# EAGLE design XBEE3_Thing_Plus (EAGLE 9.5.2)
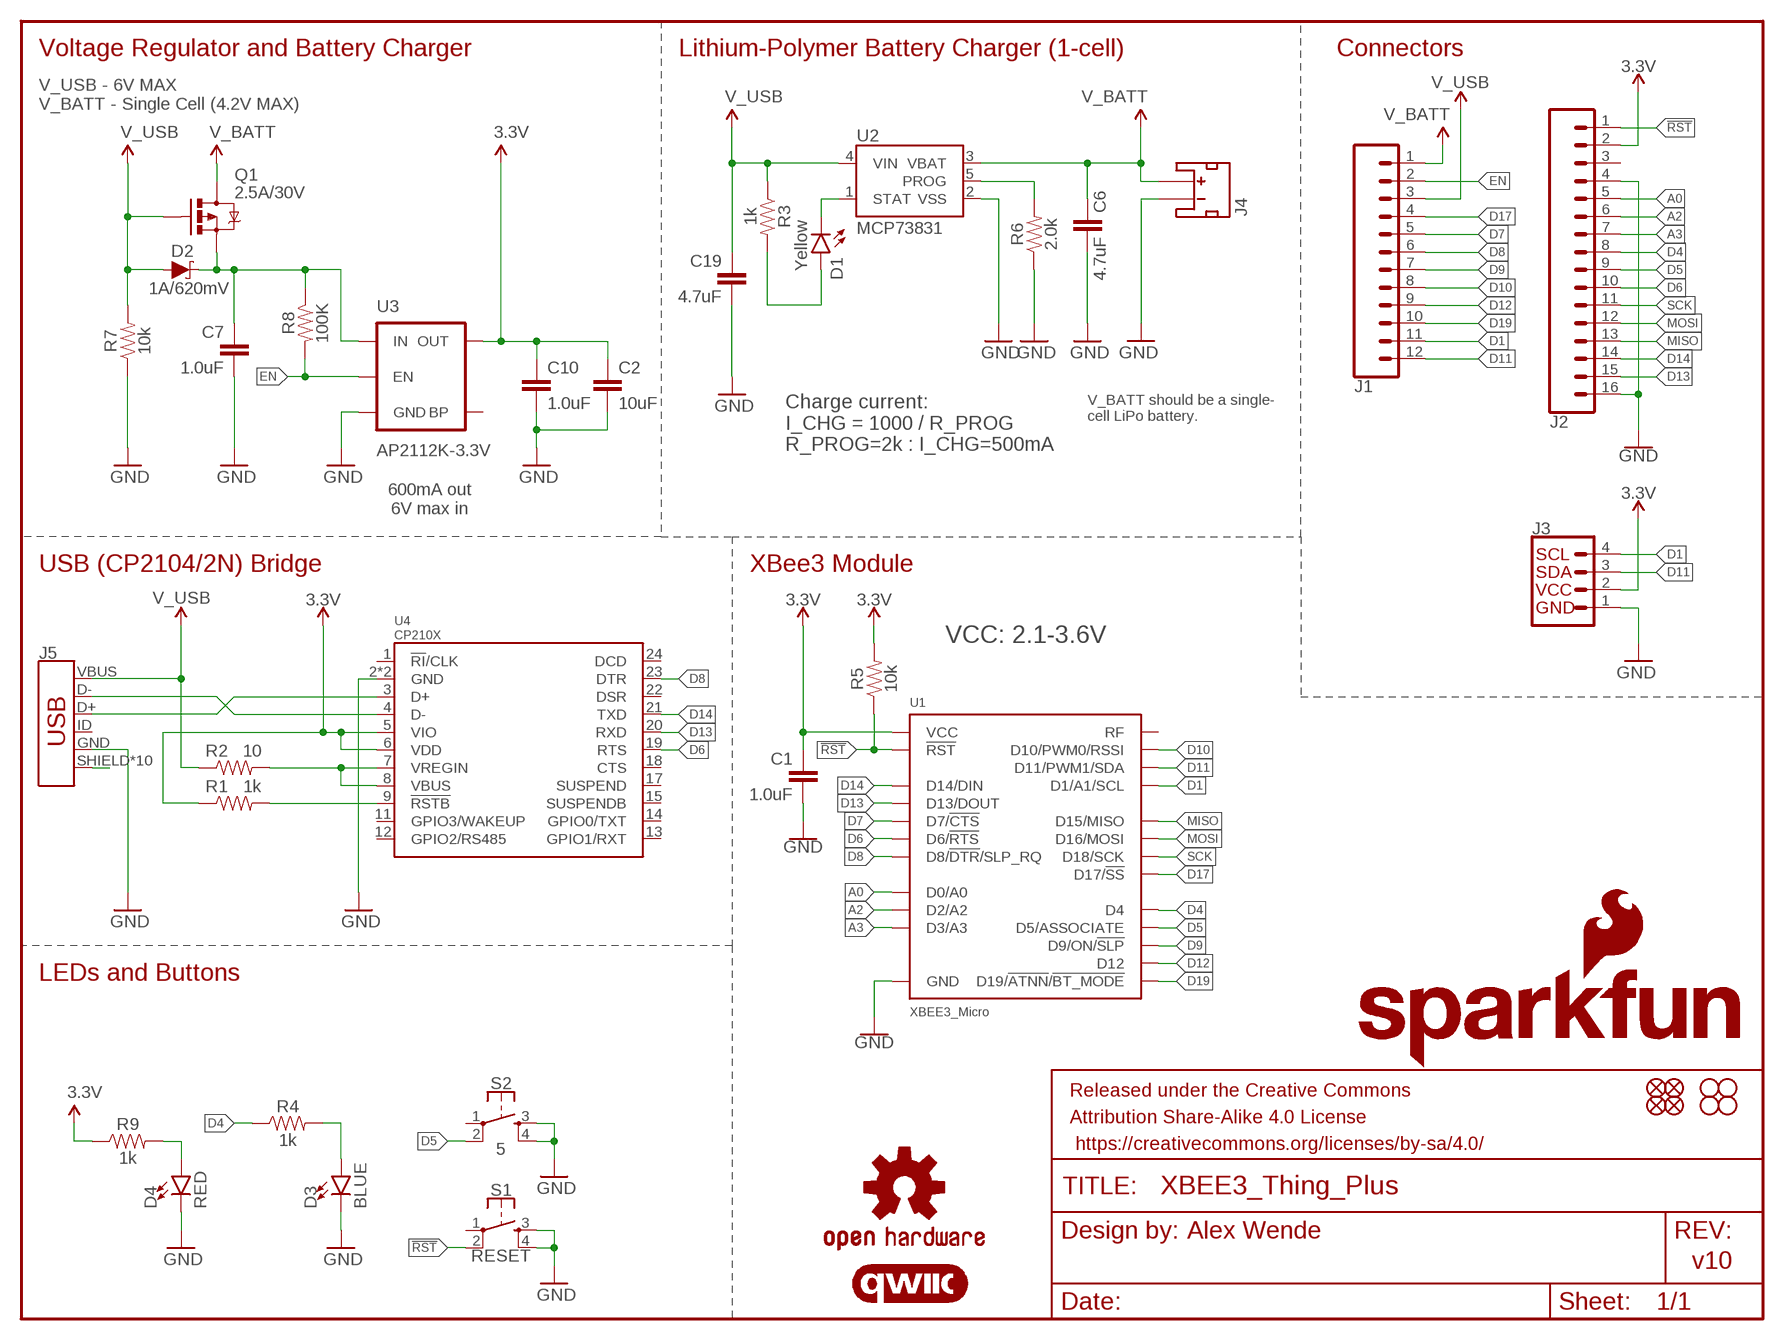
[diagram p0: schematic, sheet 1]

## Parts
C1  1.0uF  1.0UF-0603-16V-10%  [0603]
C2  10uF  10UF-0603-6.3V-20%  [0603]
C6  4.7uF  4.7UF-0603-6.3V-(10%)  [0603]
C7  1.0uF  1.0UF-0603-16V-10%-X7R  [0603]
C10  1.0uF  1.0UF-0402-16V-10%  [0402]
C19  4.7uF  4.7UF-0603-6.3V-(10%)  [0603]
D1  Yellow  LED-YELLOW0603  [LED-0603]
D2  1A/620mV  DIODE-SCHOTTKY-BAT20J  [SOD-323]
D3  BLUE  LED-BLUE0603  [LED-0603]
D4  RED  LED-RED0603  [LED-0603]
FD1  FIDUCIALUFIDUCIAL  [FIDUCIAL-MICRO]
FD2  FIDUCIALUFIDUCIAL  [FIDUCIAL-MICRO]
FD3  FIDUCIALUFIDUCIAL  [FIDUCIAL-MICRO]
FD4  FIDUCIALUFIDUCIAL  [FIDUCIAL-MICRO]
FRAME1  FRAME-LETTER  [CREATIVE_COMMONS]
H1  STAND-OFF  [STAND-OFF]
H2  STAND-OFF  [STAND-OFF]
H3  STAND-OFF  [STAND-OFF]
H4  STAND-OFF  [STAND-OFF]
J1  CONN_12SM_SQ_NO_SILK  [1X12_SM_SQ_NOSILK]
J2  CONN_161X16_SM_SQ_NOSILK  [1X16_SM_SQ_NOSILK]
J3  QWIIC_CONNECTORJS-1MM  [JST04_1MM_RA]
J4  JST_2MM_MALE  [JST-2-SMD]
J5  USB_MICRO-B_HALF_PTH_MILL  [USB-MICROB-PTH-MILL]
LOGO1  SFE_LOGO_NAME_FLAME.1_INCH  [SFE_LOGO_NAME_FLAME_.1]
LOGO2  OSHW-LOGOS  [OSHW-LOGO-S]
Q1  2.5A/30V  MOSFET-PCHANNELDMG2307L  [SOT23-3@1]
R1  1k  1KOHM-0603-1/10W-1%  [0603]
R2  10  10OHM-0603-1/10W-1%  [0603]
R3  1k  1KOHM-0603-1/10W-1%  [0603]
R4  1k  1KOHM-0603-1/10W-1%  [0603]
R5  10k  10KOHM-0603-1/10W-1%  [0603]
R6  2.0k  2.0KOHM1/10W5%(0603)  [0603]
R7  10k  10KOHM-0603-1/10W-1%  [0603]
R8  100K  100KOHM-0402-1/16W-1%  [0402]
R9  1k  1KOHM-0603-1/10W-1%  [0603]
S1  RESET  MOMENTARY-SWITCH-SPST-2-SMD-4.6X2.8MM  [TACTILE_SWITCH_SMD_4.6X2.8MM]
S2  5  MOMENTARY-SWITCH-SPST-2-SMD-4.6X2.8MM  [TACTILE_SWITCH_SMD_4.6X2.8MM]
U1  XBEE3_Micro  XBEE3  [XBEE3]
U2  MCP73831  [SOT23-5]
U3  AP2112K-3.3V  V_REG_LDOSMD  [SOT23-5]
U4  CP210X  CP2102N  [QFN24]
U$63  QWIIC_LOGO_5MM  [QWIIC_5MM]

## Nets
3.3V: C1.1 C2.1 C10.1 J2.2 J3.2 R1.1 R5.2 R9.1 U1.P$2(VCC) U3.5(OUT) U4.5(VIO) U4.6(VDD)
!RST: J2.1 R5.1 S1.2 U1.P$6(!RST)
A0: J2.5 U1.P$31(D0/A0)
A2: J2.6 U1.P$29(D2/A2)
A3: J2.7 U1.P$28(D3/A3)
CHG: D1.C U2.1(STAT)
D1: J1.11 J3.4 U1.P$30(D1/A1/SCL)
D4: J2.8 R4.1 U1.P$23(D4)
D5: J2.9 S2.2 U1.P$26(D5/ASSOCIATE)
D6: J2.10 U1.P$27(D6/!RTS) U4.19(RTS)
D7: J1.5 U1.P$24(D7/!CTS)
D8: J1.6 U1.P$9(D8/!DTR!/SLP_RQ) U4.23(DTR)
D9: J1.7 U1.P$25(D9/ON/!SLP)
D10: J1.8 U1.P$7(D10/PWM0/RSSI)
D11: J1.12 J3.3 U1.P$8(D11/PWM1/SDA)
D12: J1.9 U1.P$5(D12)
D13: J2.15 U1.P$3(D13/DOUT) U4.20(RXD)
D14: J2.14 U1.P$4(D14/DIN) U4.21(TXD)
D17: J1.4 U1.P$14(D17/!SS)
D19: J1.10 U1.P$11(D19/!ATNN!/!BT_MODE)
D+: J5.D+ U4.3(D+)
D-: J5.D- U4.4(D-)
EN: J1.2 R8.2 U3.3(EN)
GND: C1.2 C2.2 C6.2 C7.2 C10.2 C19.2 D3.C D4.C J2.4 J2.16 J3.1 J4.1(-) J5.GND R6.1 R7.1 S1.3 S1.4 S2.3 S2.4 U1.P$1(GND) U1.P$10(GND) U1.P$12(GND) U1.P$21(GND) U1.P$32(GND) U1.P$34(GND) U2.2(VSS) U3.2(GND) U4.2(GND) U4.PAD(GND)
MISO: J2.13 U1.P$16(D15/MISO)
MOSI: J2.12 U1.P$15(D16/MOSI)
N$1: C7.1 D2.C Q1.2(S) R8.1 U3.1(IN)
N$2: R1.2 U4.9(!RSTB)
N$3: R2.2 U4.7(VREGIN) U4.8(VBUS)
N$4: D3.A R4.2
N$5: D4.A R9.2
N$6: J5.SHIELD J5.SHIELD2(SHIELD) J5.SHIELD3(SHIELD) J5.SHIELD4(SHIELD) J5.SHIELD5(SHIELD) J5.SHIELD6(SHIELD) J5.SHIELD7(SHIELD) J5.SHIELD8(SHIELD) J5.SHIELD9(SHIELD) J5.SHIELD10(SHIELD)
N$14: R6.2 U2.5(PROG)
N$17: D1.A R3.2
SCK: J2.11 U1.P$13(D18/SCK)
V_BATT: C6.1 J1.1 J4.2(+) Q1.3(D) U2.3(VBAT)
V_USB: C19.1 D2.A J1.3 J5.VBUS Q1.1(G) R2.1 R3.1 R7.2 U2.4(VIN)
Unconnected: J2.3 J4.NC1(PAD1) J4.NC2(PAD2) J5.ID S1.1 S2.1 U1.P$33(RF) U3.4(BP) U4.1(!RI!/CLK) U4.11(GPIO3/WAKEUP) U4.12(GPIO2/RS485) U4.13(GPIO1/RXT) U4.14(GPIO0/TXT) U4.15(SUSPENDB) U4.17(SUSPEND) U4.18(CTS) U4.22(DSR) U4.24(DCD)

## Notes on the sheet
- Voltage Regulator and Battery Charger | Lithium-Polymer Battery Charger (1-cell) | Connectors
- V_USB - 6V MAX
  V_BATT - Single Cell (4.2V MAX)
- Charge current:
  I_CHG = 1000 / R_PROG
  R_PROG=2k : I_CHG=500mA
- V_BATT should be a single-
  cell LiPo battery.
- 600mA out
  6V max in
- USB (CP2104/2N) Bridge | XBee3 Module
- VCC: 2.1-3.6V
- LEDs and Buttons
- Alex Wende
- v10

## Library data of the parts
C1 = SparkFun-Capacitors:1.0UF: 1µF ceramic capacitors A capacitor is a passive two-terminal electrical component used to store electrical energy temporarily in an electric field.; PROD_ID: CAP-00868
C2 = SparkFun-Capacitors:10UF: 10.0µF ceramic capacitors A capacitor is a passive two-terminal electrical component used to store electrical energy temporarily in an electric field.; PROD_ID: CAP-11015
C6 C19 = SparkFun-Capacitors:4.7UF: 4.7µF ceramic capacitors A capacitor is a passive two-terminal electrical component used to store electrical energy temporarily in an electric field.; PROD_ID: CAP-08280
C7 = SparkFun-Capacitors:1.0UF: 1µF ceramic capacitors A capacitor is a passive two-terminal electrical component used to store electrical energy temporarily in an electric field.; PROD_ID: CAP-13930
C10 = SparkFun-Capacitors:1.0UF: 1µF ceramic capacitors A capacitor is a passive two-terminal electrical component used to store electrical energy temporarily in an electric field.; PROD_ID: CAP-12417
D1 = SparkFun-LED:LED-YELLOW: Yellow SMD LED Used in manufacturing several products at SparkFun. Packages: 0603 - SMD 0603 package[Product Link] <http://www.kingbrightusa.com/product.asp?catalog_name=LED&product_id=APT1608SYCK> 0603 -SMART - SMART SMD 0603 package (more efficient/more expensive) [Product Link] <http://www.osram-os.com/osram_os/en/products/product-catalog/led-light-emitting-diodes/smartled-0603/ly-l29k/index.jsp> LilyPad - SMD1206 package[Product Datasheet] <https://www.sparkfun.com/datasheets/DevTools/LilyPad/Q150YUS4.pdf> SparkFun Products: Blynk Board <https://www.sparkfun.com/products/13794> IOIO-OTG <https://www.sparkfun.com/products/13613> XBee Explorer Serial <https://www.sparkfun.com/products/13225>; PROD_ID: DIO-09003
D2 = SparkFun-DiscreteSemi:DIODE-SCHOTTKY: Schottky diode A Schottky diode is a semiconductor diode which has a low forward voltage drop and a very fast switching action.; PROD_ID: DIO-11623; VALUE: 1A/23V/620mV
D3 = SparkFun-LED:LED-BLUE: Blue SMD LED Used in manufacturing of various products at SparkFun Packages: 0603 - SMD 0603 package [Product Link] <http://www.digikey.com/product-detail/en/SMLE12BC7TT86/511-1589-2-ND/1641808> 1206 - SMD1206 package [Product Link] <http://www.digikey.com/product-detail/en/lite-on-inc/LTST-C150TBKT/160-1643-1-ND/573584> SparkFun Products: ESP8266 Thing-Dev Board <https://www.sparkfun.com/products/13711> RedBoard <https://www.sparkfun.com/products/12757>; PROD_ID: DIO-08575
D4 = SparkFun-LED:LED-RED: Red SMD LED Used in manufacturing of most products at SparkFun Packages: 0603 - SMD 0603 package [Product Link] <http://docs.avagotech.com/docs/AV02-0551EN> 0603 SMART - SMD 0603 SMART package ( more efficient and expensive)[Product Link] <http://www.osram-os.com/Graphics/XPic2/00077099_0.pdf> 1206 - SMD1206 package [Product Link] <https://www.sparkfun.com/datasheets/DevTools/LilyPad/Q150OVS4.pdff> SparkFun Products: Pro Mini 328 -5V <https://www.sparkfun.com/products/821> RedBoard <https://www.sparkfun.com/products/12757> IOIO-OTG <https://www.sparkfun.com/products/13613>; PROD_ID: DIO-00819
FD1-FD4 = SparkFun-Aesthetics:FIDUCIAL: Fiducial Alignment Points Point-of-reference for pick-and-place machines and other optical instruments.
FRAME1 = SparkFun-Aesthetics:FRAME-LETTER: Schematic Frame - Letter Standard 8.5x11 US Letter frame
H1-H4 = SparkFun-Hardware:STAND-OFF: Stand Off Drill holes for mechanically mounting via screws, standoffs, etc. Note: Use the keepout ring to avoid running the screw head into surrounding components. Variant Overviews STAND-OFF - Mechanical footprint for a #4 phillips button head screw. STAND-OFF-TIGHT - Mechanical footprint for a #4 phillips button head screw, Example SparkFun Products Screw - Phillips Head (1/4", 4-40, 10 pack) <https://www.sparkfun.com/products/10453> (PRT-10453) Screw - Phillips Head (1/2", 4-40, 10 pack) <https://www.sparkfun.com/products/10452> (PRT-10452) Screw - Phillips Head (3/4", 4-40, 10 pack) <https://www.sparkfun.com/products/10451> (PRT-10451) Screw - Phillips Head (1", 4-40, 10 pack) <https://www.sparkfun.com/products/10450> (PRT-10450)
J1 = SparkFun-Connectors:CONN_12: Multi connection point. Often used as Generic Header-pin footprint for 0.1 inch spaced/style header connections On any of the 0.1 inch spaced packages, you can populate with these: Break Away Headers - Straight <https://www.sparkfun.com/products/116> (PRT-00116) Break Away Male Headers - Right Angle <https://www.sparkfun.com/products/553> (PRT-00553) Female Headers <https://www.sparkfun.com/products/115> (PRT-00115) Break Away Headers - Machine Pin <https://www.sparkfun.com/products/117> (PRT-00117) Break Away Female Headers - Swiss Machine Pin <https://www.sparkfun.com/products/743> (PRT-00743) For SCREWTERMINALS and SPRING TERMINALS visit here: Screw Terimnals on SparkFun.com <https://www.sparkfun.com/search/results?term=Screw+Terminals> (5mm/3.5mm/2.54mm spacing) This device is also useful as a general connection point to wire up your design to another part of your project. Our various solder wires solder well into these plated through hole pads. Hook-Up Wire - Assortment (Stranded, 22 AWG) <https://www.sparkfun.com/products/11375> (PRT-11375) Hook-Up Wire - Assortment (Solid Core, 22 AWG) <https://www.sparkfun.com/products/11367> (PRT-11367) View the entire wire category on our website here <https://www.sparkfun.com/categories/141> Special notes: Molex polarized connector foot print use with SKU : PRT-08231 with associated crimp pins and housings. 1MM SMD Version SKU: PRT-10208 NOTES ON THE VARIANTS LOCK and LOCK_LONGPADS... This footprint was designed to help hold the alignment of a through-hole component (i.e. 6-pin header) while soldering it into place. You may notice that each hole has been shifted either up or down by 0.005 of an inch from it's more standard position (which is a perfectly straight line). This slight alteration caused the pins (the squares in the middle) to touch the edges of the holes. Because they are alternating, it causes a "brace" to hold the component in place. 0.005 has proven to be the perfect amount of "off-center" position when using our standard breakaway headers. Although looks a little odd when you look at the bare footprint, once you have a header in there, the alteration is very hard to notice. Also,if you push a header all the way into place, it is covered up entirely on the bottom side.
J2 = SparkFun-Connectors:CONN_16: Multi connection point. Often used as Generic Header-pin footprint for 0.1 inch spaced/style header connections On any of the 0.1 inch spaced packages, you can populate with these: Break Away Headers - Straight <https://www.sparkfun.com/products/116> (PRT-00116) Break Away Male Headers - Right Angle <https://www.sparkfun.com/products/553> (PRT-00553) Female Headers <https://www.sparkfun.com/products/115> (PRT-00115) Break Away Headers - Machine Pin <https://www.sparkfun.com/products/117> (PRT-00117) Break Away Female Headers - Swiss Machine Pin <https://www.sparkfun.com/products/743> (PRT-00743) For SCREWTERMINALS and SPRING TERMINALS visit here: Screw Terimnals on SparkFun.com <https://www.sparkfun.com/search/results?term=Screw+Terminals> (5mm/3.5mm/2.54mm spacing) This device is also useful as a general connection point to wire up your design to another part of your project. Our various solder wires solder well into these plated through hole pads. Hook-Up Wire - Assortment (Stranded, 22 AWG) <https://www.sparkfun.com/products/11375> (PRT-11375) Hook-Up Wire - Assortment (Solid Core, 22 AWG) <https://www.sparkfun.com/products/11367> (PRT-11367) View the entire wire category on our website here <https://www.sparkfun.com/categories/141> Special notes: Molex polarized connector foot print use with SKU : PRT-08231 with associated crimp pins and housings. 1MM SMD Version SKU: PRT-10208 NOTES ON THE VARIANTS LOCK and LOCK_LONGPADS... This footprint was designed to help hold the alignment of a through-hole component (i.e. 6-pin header) while soldering it into place. You may notice that each hole has been shifted either up or down by 0.005 of an inch from it's more standard position (which is a perfectly straight line). This slight alteration caused the pins (the squares in the middle) to touch the edges of the holes. Because they are alternating, it causes a "brace" to hold the component in place. 0.005 has proven to be the perfect amount of "off-center" position when using our standard breakaway headers. Although looks a little odd when you look at the bare footprint, once you have a header in there, the alteration is very hard to notice. Also,if you push a header all the way into place, it is covered up entirely on the bottom side.
J3 = SparkFun-Connectors:QWIIC_CONNECTOR: SparkFun I2C Standard Qwiic Connector An SMD 1mm pitch JST connector makes it easy and quick (get it? Qwiic?) to connect I2C devices to each other. The Qwiic system <http://www.sparkfun.com/qwiic> enables fast and solderless connection between popular platforms and various sensors and actuators. We carry 200mm <https://www.sparkfun.com/products/14204>, 100mm <https://www.sparkfun.com/products/14205>, 50mm <https://www.sparkfun.com/products/14206>, and breadboard friendly <https://www.sparkfun.com/products/14207> Qwiic cables. We also offer 10 pcs strips <https://www.sparkfun.com/products/14323> the SMD connectors.; PROD_ID: CONN-13694
J4 = SparkFun-Connectors:JST_2MM_MALE: JST 2MM MALE RA CONNECTOR Two pin, compact surface mount connector. Commonly used as a battery input connection point. We really like the solid locking feeling and high current rating on these small connectors. We use these all the time as battery connectors. Mates to single-cell LiPo batteries. Here is the connector we sell at SparkFun: JST Right Angle Connector - White <https://www.sparkfun.com/products/8612> (PRT-08612) Datasheet <http://www.sparkfun.com/datasheets/Prototyping/Connectors/JST-Horizontal.pdf> It was used on these SparkFun products: SparkFun MOSFET Power Controller <https://www.sparkfun.com/products/11214> (PRT-11214) SparkFun Battery Babysitter - LiPo Battery Manager <https://www.sparkfun.com/products/13777> (PRT-13777) And many, many others that required a lipo battery connection.; PROD_ID: CONN-11443; SF_ID: PRT-08612
J5 = SparkFun-Connectors:USB_MICRO-B: USB Type Micro-B Connector Male/female and PTH/SMT variants SparkFun Products: SparkFun microB USB Breakout <https://www.sparkfun.com/products/12035> SparkFun USB microB Plug Breakout <https://www.sparkfun.com/products/10031> SparkFun ESP8266 Thing <https://www.sparkfun.com/products/13231>; PROD_ID: CONN-13711
LOGO1 = SparkFun-Aesthetics:SFE_LOGO_NAME_FLAME: SparkFun Font Logo w/ Flame This is the SparkFun full logo. The logo on the schematic will always be the same size; the package variant is the height of the flame part of the logo. Default layer for the logo on the board is tSilk.
LOGO2 = SparkFun-Aesthetics:OSHW-LOGO: Open-Source Hardware (OSHW) Logo This logo indicates the piece of hardware it is found on incorporates a OSHW license and/or adheres to the definition of open source hardware found here: http://freedomdefined.org/OSHW
Q1 = SparkFun-DiscreteSemi:MOSFET-PCHANNEL: Generic PMOSFET IRLML2244 - TRANS-11153 (SOT-23 -20V -4.3A) (1.Gate 2.Source 3.Drain) FQP27P06 - COM-10349 <http://www.sparkfun.com/products/10349> (TO-220 -60V -27A) (1.Gate 2.Source 3.Drain); PROD_ID: TRANS-11308
R1 R3 R4 R9 = SparkFun-Resistors:1KOHM: 1kΩ resistor A resistor is a passive two-terminal electrical component that implements electrical resistance as a circuit element. Resistors act to reduce current flow, and, at the same time, act to lower voltage levels within circuits. - Wikipedia; PROD_ID: RES-07856
R2 = SparkFun-Resistors:10OHM: 10Ω resistor A resistor is a passive two-terminal electrical component that implements electrical resistance as a circuit element. Resistors act to reduce current flow, and, at the same time, act to lower voltage levels within circuits. - Wikipedia; PROD_ID: RES-12581
R5 R7 = SparkFun-Resistors:10KOHM: 10kΩ resistor A resistor is a passive two-terminal electrical component that implements electrical resistance as a circuit element. Resistors act to reduce current flow, and, at the same time, act to lower voltage levels within circuits. - Wikipedia; PROD_ID: RES-00824
R6 = SparkFun-Resistors:2.0KOHM1/10W5%(0603): RES-08296; PROD_ID: RES-08296
R8 = SparkFun-Resistors:100KOHM: 100kΩ resistor A resistor is a passive two-terminal electrical component that implements electrical resistance as a circuit element. Resistors act to reduce current flow, and, at the same time, act to lower voltage levels within circuits. - Wikipedia; PROD_ID: RES-13495
S1 S2 = SparkFun-Switches:MOMENTARY-SWITCH-SPST-2: Momentary Switch (Pushbutton) - SPST - Two Circuits Normally-open (NO) SPST momentary switches (buttons, pushbuttons). Schematic symbol includes two switch circuits. Variants SMD-4.6MMX2.8MM - 4.60mm x 2.80mm Tactile Momentary Button Switch - Used on SparkFun SAMD21 Mini Breakout <https://www.sparkfun.com/products/13664> SMD-5.2MM - Mini Pushbutton Switch - SMD <https://www.sparkfun.com/products/8720> - Used on Arduino Pro Mini <https://www.sparkfun.com/products/11114>; PROD_ID: SWCH-13065
U1 = SparkFun-RF:XBEE3; PROD_ID: WRL-14444/WRL-14467
U2 = SparkFun-PowerIC:MCP73831: Miniature single cell, fully integrated Li-Ion, Li-polymer charge management controller http://ww1.microchip.com/downloads/en/DeviceDoc/20001984g.pdf IC-09995; PROD_ID: IC-09995
U3 = SparkFun-PowerIC:V_REG_LDO: Voltage Regulator LDO Standard 150mA LDO voltage regulator in SOT-23 layout. Micrel part MIC5205. BP (by-pass) pin is used to lower output noise with 470pF cap.; PROD_ID: VREG-12457
U4 = SparkFun-IC-Comms:CP2102N; PROD_ID: IC-14020
U$63 = SparkFun-Aesthetics:QWIIC_LOGO: Qwiic Logos for placement on schematic and PCB. The 5.5mm silk logo is best for placing next to Qwiic connector.

## Board
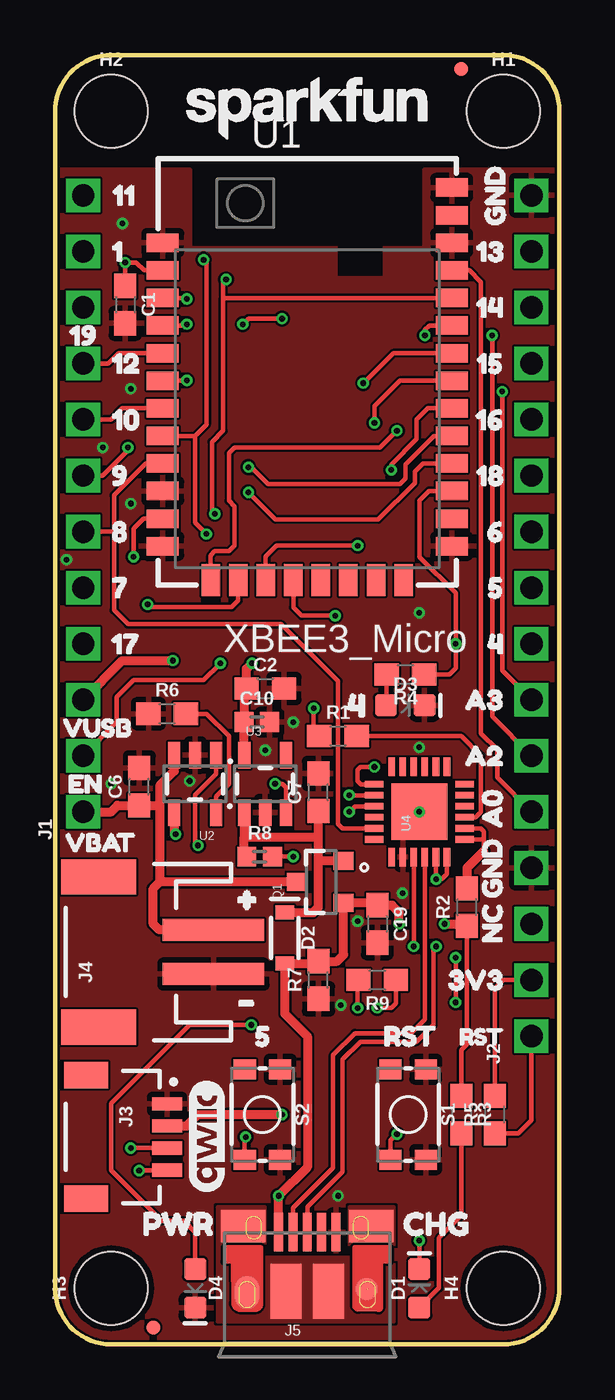
[diagram p1: board, top side]
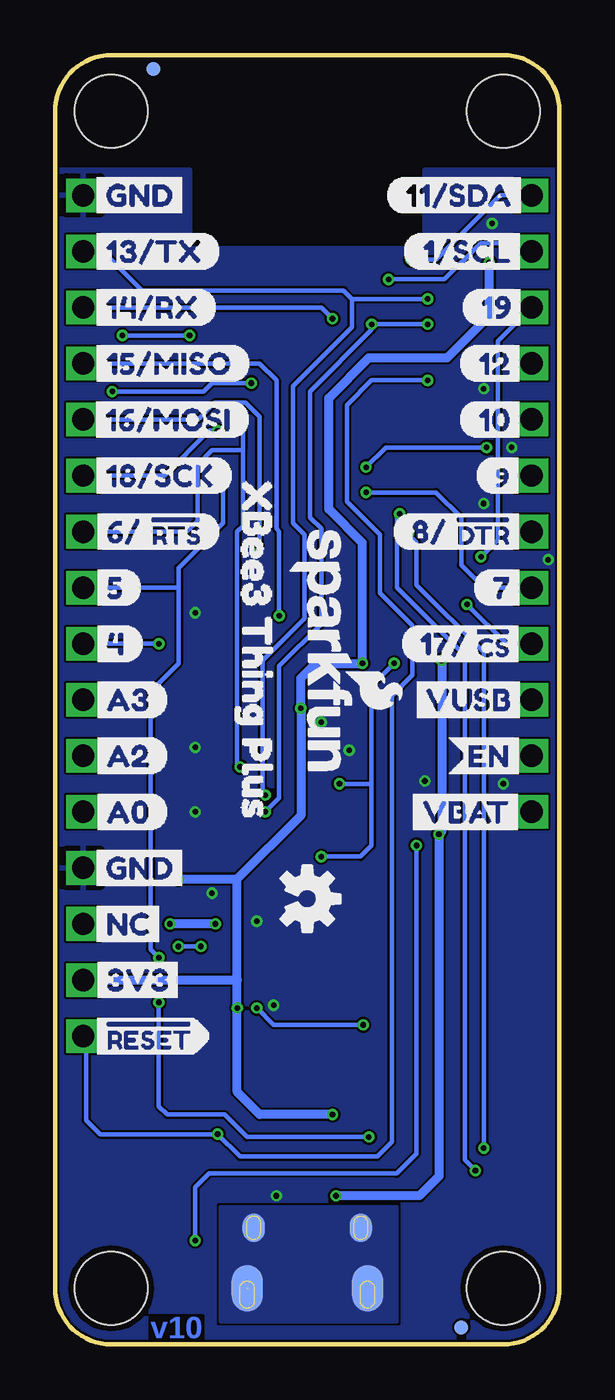
[diagram p2: board, bottom side, seen from below]

Size 22.86 x 58.42 mm. Coordinates in mm from the lower left corner, seen from the top.
Outline: 2.54,0 20.32,0 arc90 22.86,2.54 22.86,55.88 arc90 20.32,58.42 2.54,58.42 arc90 0,55.88 0,2.54 arc90 2.54,0
Copper layers (1*16): Top 0.035mm / dielectric 1.5mm / Bottom 0.035mm
Design rules "SparkFun-2-layer-FAB-LIMIT": minimum track width 4mil, minimum drill 6mil, track to track 4mil, track to pad 4mil, pad to pad 4mil, via to via 4mil, smd to smd 4mil, copper to edge 4mil, drill to drill 4mil, minimum pad ring 5mil, minimum via ring 5mil, stop-mask expansion 4mil, vias tented up to drill 25mil, thermal gap 10mil
tRestrict: 4 lines

### Footprints (pad centres in the part's own frame; a part is rotated, then mirrored left to right if it is on the bottom)
0603 = smd 1.1 x 1: 1 -0.85,0; 2 0.85,0
0402 = smd 0.85 x 0.9: 1 -0.58,0; 2 0.58,0
LED-0603 = smd 1 x 1: A -0.877,0; C 0.877,0
SOD-323 = smd 0.63 x 0.83: A 1.15,0; C -1.15,0
FIDUCIAL-MICRO = smd 0.635 x 0.635: 1 0,0
STAND-OFF = hole 3.302: 0,0
1X12_SM_SQ_NOSILK = drill 1.016 pad 1.27 square: 1 0,0; 2 2.54,0; 3 5.08,0; 4 7.62,0; 5 10.16,0; 6 12.7,0; 7 15.24,0; 8 17.78,0; 9 20.32,0; 10 22.86,0; 11 25.4,0; 12 27.94,0
1X16_SM_SQ_NOSILK = drill 1.016 pad 1.27 square: 1 0,0; 2 2.54,0; 3 5.08,0; 4 7.62,0; 5 10.16,0; 6 12.7,0; 7 15.24,0; 8 17.78,0; 9 20.32,0; 10 22.86,0; 11 25.4,0; 12 27.94,0; 13 30.48,0; 14 33.02,0; 15 35.56,0; 16 38.1,0
JST04_1MM_RA = smd 0.6 x 1.35: 1 -1.5,0; 2 -0.5,0; 3 0.5,0; 4 1.5,0 | smd 1.2 x 2: NC1 2.8,-3.675; NC2 -2.8,-3.675
JST-2-SMD = smd 1 x 4.6: 1 -1,-3.7; 2 1,-3.7 | smd 1.6 x 3.4: NC1 -3.4,1.5; NC2 3.4,1.5
USB-MICROB-PTH-MILL = smd 0.4 x 1.75: D+ 0,0; D- -0.65,0; GND 1.3,0; ID 0.65,0; VBUS -1.3,0 | smd 2 x 1.46: SHIELD -2.9,0.275; SHIELD2 2.9,0.275 | smd 1.425 x 2.5: SHIELD3 -0.963,-2.675; SHIELD4 0.963,-2.675 | smd 1.4 x 2.1 bottom: SHIELD5 -2.731,-2.531; SHIELD7 2.729,-2.531 | smd 1 x 1: SHIELD6 2.7,-2.575 | smd 1.1 x 1.5: SHIELD8 -2.731,-2.731 | smd 1 x 1.3 bottom: SHIELD9 -2.43,0.195; SHIELD10 2.43,0.195
SOT23-3@1 = smd 0.8 x 0.9: 1 -0.95,-1; 2 0.95,-1; 3 0,1.1
TACTILE_SWITCH_SMD_4.6X2.8MM = smd 0.9 x 1: 1 -2.05,-0.8; 2 2.05,-0.8; 3 2.05,0.8; 4 -2.05,0.8
XBEE3 = smd 1.448 x 0.838: P$1 -6.553,5.847; P$2 -6.553,4.597; P$3 -6.553,3.348; P$4 -6.553,2.098; P$5 -6.553,0.848; P$6 -6.553,-0.401; P$7 -6.553,-1.651; P$8 -6.553,-2.901; P$9 -6.553,-4.15; P$10 -6.553,-5.4; P$11 -6.553,-6.65; P$12 -6.553,-7.899; P$21 6.553,-7.899; P$22 6.553,-6.65; P$23 6.553,-5.4; P$24 6.553,-4.15; P$25 6.553,-2.901; P$26 6.553,-1.651; P$27 6.553,-0.401; P$28 6.553,0.848; P$29 6.553,2.098; P$30 6.553,3.348; P$31 6.553,4.597; P$32 6.553,5.847; P$33 6.553,7.097; P$34 6.553,8.346 | smd 0.838 x 1.448: P$13 -4.381,-9.436; P$14 -3.132,-9.436; P$15 -1.882,-9.436; P$16 -0.632,-9.436; P$17 0.617,-9.436; P$18 1.867,-9.436; P$19 3.117,-9.436; P$20 4.366,-9.436
SOT23-5 = smd 0.55 x 1.2: 1 -0.95,-1.3; 2 0,-1.3; 3 0.95,-1.3; 4 0.95,1.3; 5 -0.95,1.3
QFN24 = smd 0.85 x 0.3: 1 -2.05,1.25; 2 -2.05,0.75; 3 -2.05,0.25; 4 -2.05,-0.25; 5 -2.05,-0.75; 6 -2.05,-1.25; 13 2.05,-1.25; 14 2.05,-0.75; 15 2.05,-0.25; 16 2.05,0.25; 17 2.05,0.75; 18 2.05,1.25 | smd 0.3 x 0.85: 7 -1.25,-2.05; 8 -0.75,-2.05; 9 -0.25,-2.05; 10 0.25,-2.05; 11 0.75,-2.05; 12 1.25,-2.05; 19 1.25,2.05; 20 0.75,2.05; 21 0.25,2.05; 22 -0.25,2.05; 23 -0.75,2.05; 24 -1.25,2.05 | smd 2.55 x 2.55: PAD 0,0

### Placement (x,y rotation side)
C1  3.17,47.12 270 top
C2  9.53,29.72 0 top
C6  3.81,25.27 90 top
C7  11.94,25.02 90 top
C10  9.14,28.19 0 top
C19  14.61,19.05 270 top
D1  16.51,2.54 90 top
D2  10.41,18.41 270 top
D3  15.88,28.96 0 top
D4  6.35,2.54 270 top
FD1  4.45,0.76 0 top
FD2  4.45,0.76 0 bottom
FD3  18.41,57.78 0 top
FD4  18.41,57.78 0 bottom
FRAME1  -12.7,-19.05 0 top  (outside the outline)
H1  20.32,55.88 0 top
H2  2.54,55.88 0 top
H3  2.54,2.54 90 top
H4  20.32,2.54 90 top
J1  1.27,24.13 90 top
J2  21.59,13.97 90 top
J3  5.08,9.4 270 top
J4  3.48,17.78 90 top
J5  11.43,5.08 0 top
LOGO1  10.79,31.37 270 bottom
LOGO2  11.43,20.19 270 bottom
Q1  12.06,20.95 90 top
R1  12.83,27.56 0 top
R2  18.67,19.81 90 top
R3  18.41,10.41 270 top
R4  15.88,30.35 180 top
R5  19.94,10.41 90 top
R6  5.08,28.57 0 top
R7  11.94,16.51 90 top
R8  9.27,22.1 0 top
R9  14.61,16.51 180 top
S1  16,10.41 270 top
S2  9.4,10.41 270 top
U1  11.43,44.07 0 top
U2  6.35,25.4 180 top
U3  9.53,25.4 0 top
U4  16.51,24.13 90 top
U$1  [#RESET0]  21.59,13.97 0 bottom
U$2  [3V31]  21.46,16.51 0 bottom
U$3  [NC2]  21.46,19.05 0 bottom
U$4  [GND3]  21.46,21.59 0 bottom
U$5  [A04]  21.46,24.13 0 bottom
U$6  [A26]  21.46,26.67 0 bottom
U$7  [A35]  21.46,29.21 0 bottom
U$8  [47]  21.46,31.75 0 bottom
U$9  [58]  21.46,34.29 0 bottom
U$11  [18#SCK10]  21.46,39.37 0 bottom
U$12  [16#MOSI11]  21.53,41.91 0 bottom
U$13  [15#MISO12]  21.46,44.45 0 bottom
U$14  [14#RX13]  21.46,46.99 0 bottom
U$15  [13#TX14]  21.46,49.53 0 bottom
U$16  [GND3]  21.46,52.07 0 bottom
U$17  [VBAT16]  7.11,24.13 0 bottom
U$18  [EN17]  5.08,26.67 0 bottom
U$19  [VUSB18]  6.99,29.21 0 bottom
U$20  [SFE_LOGO_NAME_.1]  11.43,56.01 0 top
U$21  [719]  3.94,34.29 0 bottom
U$23  [921]  3.81,39.37 0 bottom
U$24  [1022]  4.57,41.91 0 bottom
U$25  [1223]  4.57,44.45 0 bottom
U$26  [1924]  4.45,46.99 0 bottom
U$27  [1#SCL25]  7.11,49.53 0 bottom
U$28  [11#SDA26]  7.87,52.07 0 bottom
U$29  [170]  1.78,31.75 0 top
U$30  [131]  18.29,49.53 0 top
U$31  [142]  18.29,46.99 0 top
U$32  [153]  18.16,44.45 0 top
U$33  [164]  18.29,41.91 0 top
U$34  [185]  18.29,39.37 0 top
U$35  [66]  18.8,36.83 0 top
U$36  [57]  18.67,34.29 0 top
U$37  [48]  18.8,31.75 0 top
U$38  [A39]  17.78,29.21 0 top
U$39  [A210]  17.78,26.67 0 top
U$40  [A011]  19.81,22.61 90 top
U$41  [GND12]  19.81,19.43 90 top
U$42  [NC13]  19.81,17.4 90 top
U$43  [3V314]  17.02,16.51 0 top
U$44  [#RST15]  17.4,14.1 0 top
U$45  [1116]  1.65,52.07 0 top
U$46  [117]  1.78,49.53 0 top
U$47  [1918]  -0.13,45.72 0 top
U$48  [1219]  1.78,44.45 0 top
U$49  [1020]  1.78,41.91 0 top
U$50  [921]  1.78,39.37 0 top
U$51  [822]  1.78,36.83 0 top
U$52  [723]  1.78,34.29 0 top
U$54  [VUSB4]  -0.38,27.94 0 top
U$55  [EN3]  -0.13,25.4 0 top
U$56  [PWR0]  3.05,5.46 0 top
U$57  [51]  8.26,13.97 0 top
U$58  [RST0]  14.1,13.97 0 top
U$59  [44]  12.32,28.96 0 top
U$60  [VBAT2]  -0.25,22.73 0 top
U$61  [CHG1]  14.86,5.46 0 top
U$62  [GND12]  19.94,49.91 90 top
U$63  6.86,9.4 90 top
U$64  [#1]  7.11,20.32 0 top
U$65  [XBEE3_THING_PLUS0]  13.72,40.26 270 bottom
U$66  [#2]  7.11,15.75 0 top
U$67  [6#0]  21.46,36.83 0 bottom
U$68  [#RTS1]  19.56,36.83 0 bottom
U$69  [#DTR3]  5.71,36.83 0 bottom
U$70  [8#2]  7.62,36.83 0 bottom
U$71  [17#4]  7.24,31.75 0 bottom
U$72  [#CS5]  4.83,31.75 0 bottom

### Tracks (layer width: path | path; a pad name or v marks a point on that pad's centre or on a via)
3.3V  (via drill 0.25)
  Top 0.203: U4.5 17.27,22.07 v17.27,21.08 17.53,21.08 17.76,21.32 U4.6 | v11.72,28.83 11.72,27.81 R1.1 | R5.2 19.94,16.13 20.32,16.51 J2.2 | R9.1 15.46,15.46 15.24,15.24 v14.61,15.24 | C1.1 v3.17,49.02 3.68,49.02 4.04,48.67 U1.P$2
  Top 0.406: U3.5 8.57,28.19 | 8.57,28.19 C10.1 | 8.57,28.19 8.57,29.72 C2.1 8.68,30.61 v8.93,30.86 | J3.2 5.97,9.9 6.49,10.41 v10.29,10.41
  Bottom 0.406: v10.29,10.41 13.59,10.41 14.61,11.43 v14.61,15.24 14.61,16.51 | v17.27,21.08 14.61,21.08 | 14.61,16.51 14.61,21.08 | 14.61,21.08 11.72,23.96 v11.72,28.83 11.72,30.19 11.05,30.86 v8.93,30.86 8.93,36.32 10.45,37.85 10.45,42.89 8.64,44.7 5.08,44.7 3.17,46.61 v3.17,49.02 | J2.2 14.61,16.51
!RST  (via drill 0.25)
  Top 0.203: v5.97,43.69 5.97,43.67 U1.P$6 | R5.1 20.99,9.56 21.59,10.16 J2.1 | S1.2 15.2,9.23 v15.49,9.53
  Bottom 0.203: v5.97,43.69 8.51,43.69 9.63,42.57 9.63,38.2 8.13,36.7 8.13,34.04 6.66,32.56 6.66,30.33 7.59,29.39 7.59,9.17 8.26,8.51 14.48,8.51 v15.49,9.53 20.83,9.53 21.46,10.16 21.46,13.84 J2.1
A0
  Top 0.203: J2.5 20.04,25.68 20.04,26.95 19.3,27.69 19.3,48.13 18.77,48.67 U1.P$31
A2  (via drill 0.25)
  Top 0.203: v19.81,45.72 19.81,28.45 J2.6 | U1.P$29 16.96,46.17 16.76,45.97 v16.76,45.72
  Bottom 0.203: v16.76,45.72 v19.81,45.72
A3  (via drill 0.25)
  Top 0.203: v20.27,43.18 20.27,30.53 J2.7 | U1.P$28 15.33,44.92 v13.97,43.56
  Bottom 0.203: v13.97,43.56 15.75,43.56 16.13,43.18 v20.27,43.18
CHG  (via drill 0.25)
  Top 0.203: U2.1 7.3,25.84 6.35,24.89 6.35,22.73 v6.48,22.61 | v16.51,4.7 D1.C
  Bottom 0.203: v6.48,22.61 6.48,8.64 7.37,7.75 15.88,7.75 16.51,7.11 v16.51,4.7
D1  (via drill 0.25)
  Top 0.203: 7.62,47.42 7.62,41.4 7.11,40.89 7.11,37.77 v7.24,37.64 | v7.75,48.26 7.62,48.13 7.62,47.42 | J3.4 5.08,7.87 v3.81,7.87 | U1.P$30 7.62,47.42
  Bottom 0.203: v3.81,7.87 4.29,8.36 4.29,31.22 7.37,34.29 7.37,37.51 v7.24,37.64 | v7.75,48.26 5.21,48.26 3.56,49.91 2.54,49.91 2.16,49.53 J1.11
D4  (via drill 0.25)
  Top 0.203: R4.1 17.87,30.35 18.16,30.65 v18.16,31.75 18.16,34.04 16.51,35.69 16.51,38.23 16.95,38.67 U1.P$23
  Bottom 0.203: v18.16,31.75 J2.8
D5  (via drill 0.25)
  Top 0.203: v18.16,17.53 v18.16,15.49 | S2.2 8.6,9.4 v8.64,9.4 | U1.P$26 16.89,42.42 16.38,41.91 16.38,41.02 15.24,39.88 v15.24,39.62
  Bottom 0.203: v18.16,17.53 18.54,17.91 18.54,29.59 17.27,30.86 17.27,34.29 | v18.16,15.49 18.16,10.79 17.78,10.41 15.18,10.41 14.16,9.4 v8.64,9.4 | 17.27,34.29 17.27,35.18 15.24,37.21 v15.24,39.62 | J2.9 17.27,34.29
D6  (via drill 0.25)
  Top 0.203: U4.19 13.86,25.38 13.72,25.53 13.72,26.04 13.84,26.16 v14.48,26.16 | U1.P$27 15.62,43.67 14.48,42.52 v14.48,41.76
  Bottom 0.203: 14.35,40.51 14.35,41.64 v14.48,41.76 | v14.48,26.16 14.61,26.29 14.61,36.83 14.35,37.08 14.35,40.51 | J2.10 16.89,36.83 16.41,37.31 16.41,39.85 15.75,40.51 14.35,40.51
D7  (via drill 0.25)
  Top 0.203: v8.76,38.61 9.99,37.38 14.65,37.38 16.31,39.04 16.31,39.55 16.68,39.92 U1.P$24
  Bottom 0.203: J1.5 3.43,34.29 4.45,35.31 4.45,37.47 5.59,38.61 v8.76,38.61
D8
  Top 0.203: J1.6 2.67,36.83 | 2.67,36.83 2.67,33.27 3.3,32.64 10.24,32.64 12.83,30.05 12.83,23.57 13.02,23.38 U4.23 | U1.P$9 4.11,39.92 2.67,38.48 2.67,36.83
D9  (via drill 0.25)
  Top 0.203: J1.7 2.16,39.37 3.3,40.51 v3.3,40.64 | v8.76,39.75 8.89,39.75 9.65,38.99 15.62,38.99 15.88,39.24 15.88,39.88 17.16,41.17 U1.P$25
  Bottom 0.203: v8.76,39.75 7.87,40.64 v3.3,40.64
D10
  Top 0.203: J1.8 2.54,41.91 3.05,42.42 U1.P$7
D11  (via drill 0.25)
  Top 0.203: 6.35,41.17 6.35,37.23 v6.86,36.72 | 6.35,41.17 6.86,41.68 6.86,49.15 v6.73,49.15 | J3.3 v3.43,8.9 v3.43,8.89 | U1.P$8 6.35,41.17
  Bottom 0.203: v3.43,8.89 3.43,31.37 6.48,34.42 6.48,36.34 v6.86,36.72 | J1.12 2.67,52.07 5.59,49.15 v6.73,49.15
D12
  Top 0.203: J1.9 2.41,44.45 2.88,44.92 U1.P$5
D13  (via drill 0.25)
  Top 0.203: U4.20 v13.35,24.88 v13.34,24.89 | v5.97,47.37 5.92,47.42 U1.P$3
  Bottom 0.203: v13.34,24.89 13.46,25.02 13.46,30.99 11.56,32.89 11.56,36.7 12.06,37.21 12.06,43.43 9.4,46.1 9.4,47.37 | J2.15 20.7,49.53 18.92,47.75 9.78,47.75 9.4,47.37 | v5.97,47.37 9.4,47.37
D14  (via drill 0.25)
  Top 0.203: U4.21 13.59,24.38 v13.34,24.13 | v5.97,46.23 5.91,46.17 U1.P$4 | v10.29,46.48 8.76,46.48 v8.51,46.23
  Bottom 0.203: v13.34,24.13 12.7,24.77 12.7,30.73 10.79,32.64 10.79,36.96 11.3,37.47 11.3,43.18 8.51,45.97 v8.51,46.23 v5.97,46.23 | J2.14 10.79,46.99 v10.29,46.48
D17  (via drill 0.25)
  Top 0.203: U1.P$14 8.3,33.7 8,33.4 4.32,33.4 v4.19,33.53
  Bottom 0.203: v4.19,33.53 2.41,31.75 J1.4
D19  (via drill 0.25)
  Top 0.203: U1.P$11 4.02,37.42 3.56,36.96 v3.56,35.69
  Bottom 0.203: J1.10 2.79,45.47 2.79,36.45 v3.56,35.69
D+  (via drill 0.25)
  Top 0.203: v17.27,18.03 17.14,17.9 17.14,14.47 16.38,13.72 13.84,13.72 13.03,12.9 13.03,7.83 11.43,6.23 J5.D+ | v16.26,18.03 v16.26,18.04 U4.3
  Bottom 0.203: v16.26,18.03 v17.27,18.03
D-
  Top 0.203: U4.4 16.76,14.73 16.13,14.1 13.59,14.1 12.6,13.11 12.6,8.01 10.78,6.19 J5.D-
EN  (via drill 0.25)
  Top 0.203: U3.3 10.47,25.24 10.32,25.4 v9.97,25.4 | v10.79,22.1 R8.2 | J1.2 2.79,28.19 2.79,29.34 3.56,30.1 6.73,30.1 v7.49,30.86
  Bottom 0.203: 8.51,25.4 8.51,29.84 v7.49,30.86 | 8.51,25.4 8.51,22.61 9.02,22.1 v10.79,22.1 | v9.97,25.4 8.51,25.4
GND  (via drill 0.25)
  Top 0.152: 12.73,6.73 v12.83,6.73
  other vias: 6.1,25.53 16.51,24.13 2.54,25.4 13.72,19.18 3.05,50.8 15.75,20.45 16.51,33.15 12.95,15.37 9.53,26.92 10.79,28.19 16.51,27.05 3.43,43.31 2.16,40.64 3.43,38.1 0.51,35.56
  pour Top (rank 2): 22.86,0 22.86,53.21 16.76,53.21 16.76,49.66 6.1,49.66 6.1,53.21 0,53.21 0,0
  pour Bottom (rank 2): 22.86,0 22.86,53.21 16.76,53.21 16.76,49.66 6.1,49.66 6.1,53.21 0,53.21 0,0
MISO  (via drill 0.25)
  Top 0.203: v12.7,33.02 11.18,33.02 10.8,33.4 U1.P$16
  Bottom 0.203: J2.13 13.59,44.45 12.83,43.69 12.83,36.96 12.7,36.83 v12.7,33.02
MOSI  (via drill 0.25)
  Top 0.203: v13.72,36.2 10.03,36.2 9.55,35.71 U1.P$15
  Bottom 0.203: v13.72,36.2 13.59,36.32 13.59,42.04 14.22,42.67 15.62,42.67 16.38,41.91 J2.12
N$1
  Top 0.406: D2.C 11.69,19.57 11.94,19.81 11.94,21.91 | 11.94,21.91 11.94,22.99 | 11.94,22.99 C7.1 | Q1.2 11.94,21.91 | 8.57,22.99 11.94,22.99 | U3.1 8.57,22.99 | R8.1 8.57,22.1 8.57,22.99
N$2
  Top 0.203: R1.2 18.41,27.56 19.3,26.67 19.3,24.13 19.05,23.88 U4.9
N$3
  Top 0.203: U4.8 19.29,23.38 19.43,23.24 19.43,22.88 | 19.43,22.88 U4.7 | 19.43,22.88 19.43,22.35
  Top 0.406: R2.2 18.67,21.59 19.43,22.35
N$4
  Top 0.203: R4.2 15.03,28.98 D3.A
N$5  (via drill 0.25)
  Top 0.203: D4.A 6.35,5.08 5.84,5.59 4.83,5.59 2.54,7.87 2.54,10.92 6.1,14.48 v8.89,14.48 | v13.72,15.24 13.72,16.47 R9.2
  Bottom 0.203: v8.89,14.48 12.95,14.48 v13.72,15.24
N$6  (1 unrouted)
  pour Bottom (no thermals): 7.37,6.22 15.37,6.22 15.37,1.02 7.37,1.02
  pour Top (no thermals): 7.37,6.22 9.53,6.22 9.53,3.94 13.34,3.94 13.34,6.22 15.37,6.22 15.37,1.02 7.37,1.02
N$14
  Top 0.203: R6.2 6.86,28.57 7.87,27.56 7.87,25.4 7.3,24.83 U2.5
N$17
  Top 0.203: D1.A 17.4,2.55 17.4,4.83 18.41,5.84 R3.2
SCK  (via drill 0.25)
  Top 0.203: v15.49,41.4 14.73,40.64 8.13,40.64 7.87,40.39 7.87,38.23 8.13,37.97 8.13,36.2 7.87,35.94 7.24,35.94 7.05,35.75 U1.P$13
  Bottom 0.203: v15.49,41.4 15.88,41.4 17.91,39.37 J2.11
V_BATT
  Top 0.406: U2.3 5.4,25.97 4.74,25.32 4.74,24.42 | 4.74,24.42 4.74,20.95 | 4.74,24.42 C6.1 2.83,24.42 2.54,24.13 J1.1 | Q1.3 4.74,20.95 | 4.74,20.95 4.45,20.66 4.45,19.05 4.71,18.78 J4.2
V_USB  (via drill 0.25)
  Top 0.203: 13.08,19.99 Q1.1 | 18.58,19.05 R2.1 18.67,13.59 18.41,13.34 R3.1
  Top 0.406: J1.3 3.05,30.99 v5.33,30.99 | U2.4 5.4,23.18 v5.46,23.11 | J5.VBUS v10.13,6.73 11.43,8.03 11.43,13.96 10.41,14.98 D2.A 11.84,17.27 R7.2 12.79,17.36 13.08,17.65 13.08,19.99 | Q1.1 14.5,20 C19.1 15.28,19.9 15.6,19.58 v15.6,19.05 | v17.65,19.05 18.58,19.05
  Bottom 0.406: v15.6,19.05 v17.65,19.05 | v5.33,30.99 5.33,23.24 v5.46,23.11 5.46,7.62 6.35,6.73 v10.13,6.73

### Text on the board
Bottom: v10
tDocu: Alex Wende